# Altium schematic sheet TSALsch.SchDoc: TSAL
size A4; Author: Om Sarulkar; DrawnBy: Om Sarulkar; Organization: TS; DocumentNumber: 1; SheetNumber: 1; SheetTotal: 1
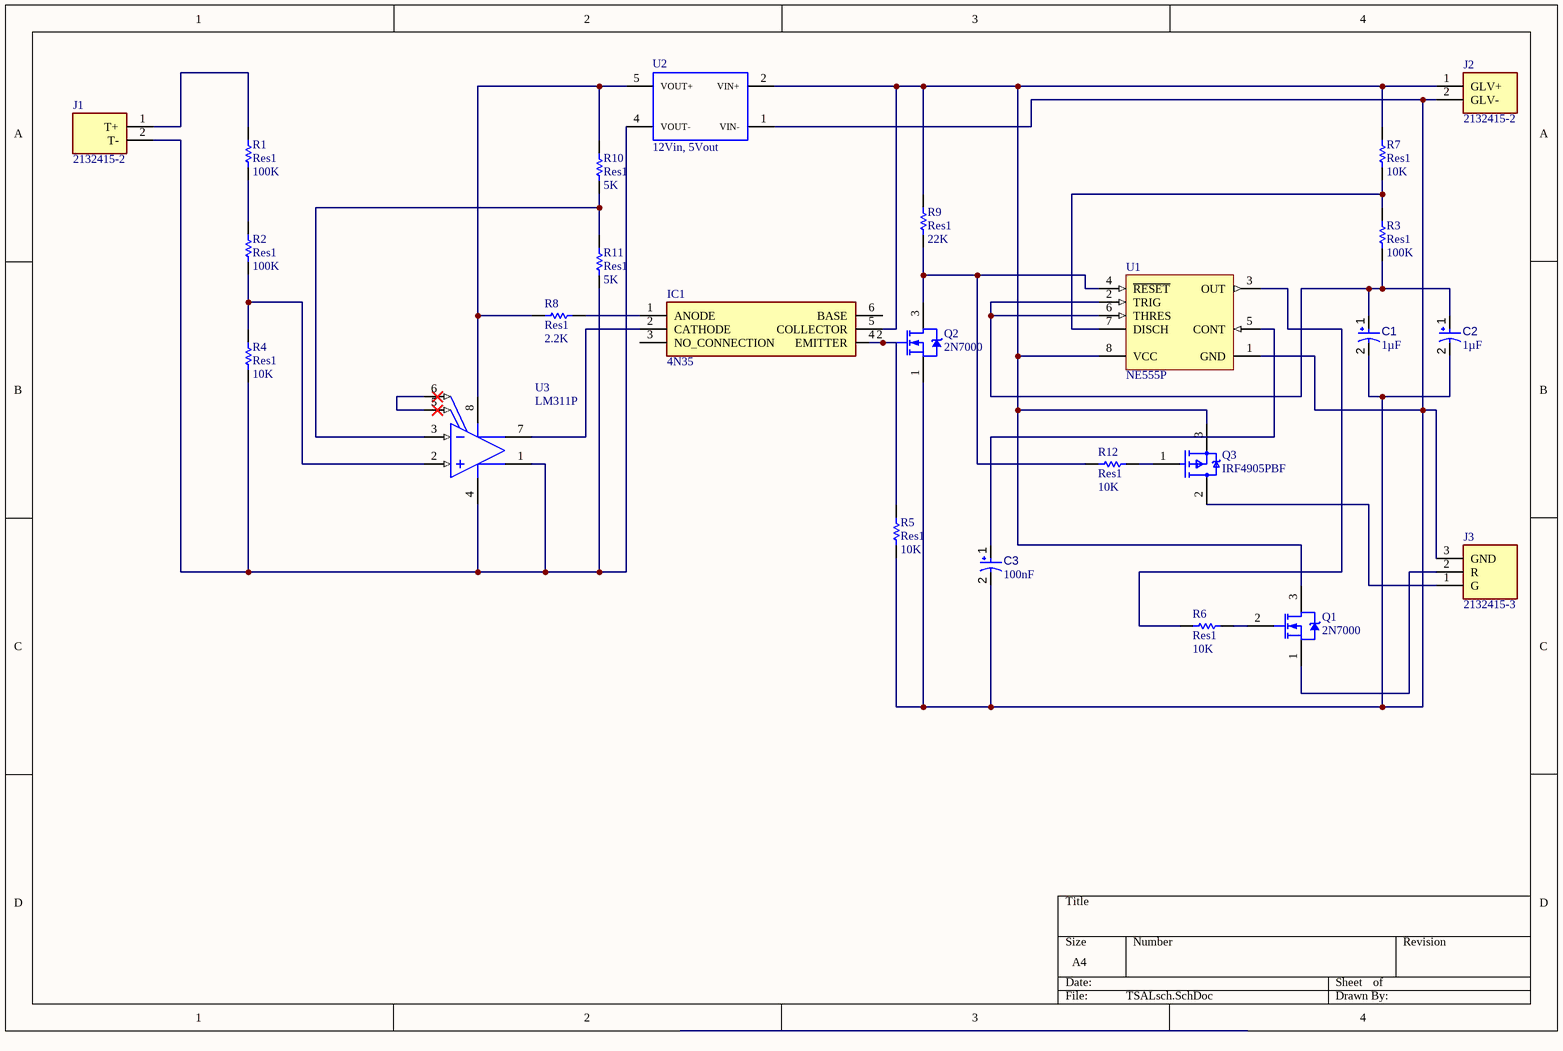
[diagram p0: TSALsch.SchDoc]

## Parts
C1  value 1µF  [CAPPR55-250-1120X630X1220]  (hidden comment: ECA-1HM470)
C2  value 1µF  [CAPPR55-250-1120X630X1220]  (hidden comment: ECA-1HM470)
C3  value 100nF  [CAPPR55-250-1120X630X1220]  (hidden comment: ECA-1HM470)
IC1  4N35  [DIP762W56P254L864H508Q6N]
J1  2132415-2  [TE_2132415-2]
J2  2132415-2  [TE_2132415-2]
J3  2132415-3  [TE_2132415-3]
Q1  2N7000  [ONSC-TO-92-3-29-11_AM_BL]
Q2  2N7000  [ONSC-TO-92-3-29-11_AM_BL]
Q3  IRF4905PBF  [FP-PG-TO220-3-MFG]
R1  Res1  value 100K  [AXIAL-0.3]
R2  Res1  value 100K  [AXIAL-0.3]
R3  Res1  value 100K  [AXIAL-0.3]
R4  Res1  value 10K  [AXIAL-0.3]
R5  Res1  value 10K  [AXIAL-0.3]
R6  Res1  value 10K  [AXIAL-0.3]
R7  Res1  value 10K  [AXIAL-0.3]
R8  Res1  value 2.2K  [AXIAL-0.3]
R9  Res1  value 22K  [AXIAL-0.3]
R10  Res1  value 5K  [AXIAL-0.3]
R11  Res1  value 5K  [AXIAL-0.3]
R12  Res1  value 10K  [AXIAL-0.3]
U1  NE555P  [P0008A]
U2  12Vin, 5Vout  [SMT-8]
U3  LM311P  [P0008A]

## Nets
NetC1_1: C1.1 C2.1 R3.1 U1.2(TRIG) U1.6(THRES)
NetC1_2: C1.2 C2.2 C3.2 J2.2(GLV-) J3.3(GND) Q2.1(S) R5.1 U1.1(GND) U2.1(VIN-)
NetC3_1: C3.1 U1.5(CONT)
NetIC1_1: IC1.1(ANODE) R8.2
NetIC1_2: IC1.2(CATHODE) U3.7(COL_OUT)
NetIC1_4: IC1.4(EMITTER) Q2.2(G) R5.2
NetIC1_5: IC1.5(COLLECTOR) J2.1(GLV+) Q1.3(D) Q3.3(SOURCE) R7.2 R9.2 U1.8(VCC) U2.2(VIN+)
NetJ1_1: J1.1(T+) R1.2
NetJ1_2: J1.2(T-) R4.1 R11.1 U2.4(VOUT-) U3.1(EMIT_OUT) U3.4(VCC-)
NetJ3_1: J3.1(G) Q3.2(DRAIN)
NetJ3_2: J3.2(R) Q1.1(S)
NetQ1_2: Q1.2(G) R6.2
NetQ2_3: Q2.3(D) R9.1 R12.1 U1.4(~{RESET})
NetQ3_1: Q3.1(GATE) R12.2
NetR1_1: R1.1 R2.2
NetR2_1: R2.1 R4.2 U3.2(IN+)
NetR3_2: R3.2 R7.1 U1.7(DISCH)
NetR6_1: R6.1 U1.3(OUT)
NetR8_1: R8.1 R10.2 U2.5(VOUT+) U3.8(VCC+)
NetR10_1: R10.1 R11.2 U3.3(IN-)
NetU3_5: U3.5(BALANCE) U3.6(BAL/STRB)

Not connected (* = marked no-connect by the designer): IC1 3(NO_CONNECTION) 6(BASE)

## Library data of the parts
C1-C3 = CMP-001-00031-6: Aluminum Electrolytic Capacitor, 47 uF, +/-20%, 50 V, -40 to 85 degC, 2-Pin THD, RoHS, Bulk; Manufacturer: Panasonic; Ripple Current (AC): 130mA; Tolerance: 20%; Voltage Rating: 50V; Packaging: Bulk; Manufacturer URL: http://www.panasonic.com/; Package Quantity: 200; Capacitor Type: Electrolytic; Pins: 2; Case/Package: Radial; Diameter: 6.3mm; Datasheet URL: https://industrial.panasonic.com/cdbs/www-data/pdf/RDF0000/DMF0000COL72.pdf; RoHS Compliant: True; Ripple Current: 130mA; Max Operating Temperature: 85°C; Datasheet Version: Apr-16; Mounting Technology: TH; Min Operating Temperature: -40°C; Package Reference: CAPPR55-250-1120X630X1220; Package Description: 2-Pin Radial Lead, Dia 6.3 mm, Height 12.2 mm; Lead Pitch: 2.5mm
IC1 = 4N35: Integrated Circuit; Manufacturer_Name: ON Semiconductor; Datasheet Link: https://eu.mouser.com/datasheet/2/308/Fairchild%20Semiconductor_4n25-28_35-37_h11a1-a5-1190949.pdf; Height: 5.08mm; Manufacturer_Part_Number: 4N35; Mouser Part Number: 512-4N35; Mouser Price/Stock: https://www.mouser.co.uk/ProductDetail/ON-Semiconductor-Fairchild/4N35?qs=9h%252BT%2FFFCxR8I%2FJMe3yKdFg%3D%3D
J1 J2 = 2132415-2: Conn Shrouded Header HDR 2 POS 2.5mm Solder ST Thru-Hole Bag/Box; Product_Type: Connector; Number_of_Positions: 2; Centerline_Pitch: 2.5 mm[.098 in]; MF: TE Connectivity; SnapEDA_Link: https://www.snapeda.com/parts/2132415-2/TE%20Connectivity%20AMP%20Connectors/view-part/2233226/?ref=snap; Digi-Key_Part_Number: A101065-ND; MP: 2132415-2; Purchase-URL: https://pricing.snapeda.com/search/part/2132415-2/?ref=eda; Package: None; Value: *; Check_prices: https://www.snapeda.com/parts/2132415-2/TE%20Connectivity%20AMP%20Connectors/view-part/2233226/?ref=eda
J3 = 2132415-3: Conn Shrouded Header HDR 3 POS 2.5mm Solder ST Thru-Hole Bag/Box; Product_Type: Connector; Centerline_Pitch: 2.5 mm[.098 in]; Number_of_Positions: 3; MF: TE Connectivity; Availability: Unavailable; Package: None; SnapEDA_Link: https://www.snapeda.com/parts/2132415-3/TE%20Connectivity%20AMP%20Connectors/view-part/2469125/?ref=snap; MP: 2132415-3; Price: None; TE_purchase_URL: https://www.te.com/usa-en/product-2132415-3.html?te_bu=Cor&te_type=disp&te_campaign=seda_glo_cor-seda-global-disp-prtnr-fy19-seda-model-bom-cta_sma-317_1&elqCampaignId=32493; Value: *
Q1 Q2 = CMP-013-00020-3: Small Signal MOSFET, 200 mA, 60 V, N-Channel, 3-Pin TO-92, Bulk Box; Manufacturer: Fairchild Semiconductor; Nominal Vgs: 2.1V; Elements: 1; Package Version: Rev. AM; Rds On Max: 5Ohm; Input Capacitance: 50pF; Nominal Dual Supply Voltage: 60V; Power: 400mW; Max Operating Temperature: 150°C; Datasheet URL: http://www.onsemi.com/pub_link/Collateral/2N7000-D.PDF; Mounting Technology: TH; RoHS Compliant: True; Case/Package: TO-92; Package Quantity: 2000; Package Description: 3-Pin Transistor Outline, Body 4.825 x 3.685 mm, Pitch 1.27 mm; Pins: 3; Min Operating Temperature: -55°C; Packaging: Bulk; Package Reference: TO-92-3-29-11_AM_BL; Datasheet Version: Rev. 8, 04/2011
Q3 = CMP-32901-000200-1: MOSFET P-CH 55V 74A TO-220AB; Drain to Source Resistance: 20mR; Input Capacitance: 3.4nF; Max Dual Supply Voltage: -55V; Power Dissipation: 200W; Turn-On Delay Time: 18ns; Element Configuration: Single; Threshold Voltage: -4V; Gate to Source Voltage (Vgs): 20V; Turn-Off Delay Time: 61ns; Number of Pins: 3; Packaging: Rail/Tube; RoHS Compliant: Yes; REACH SVHC: No SVHC; Halogen Free: Halogen Free; Max Power Dissipation: 200W; Drain to Source Breakdown Voltage: -55V; Length: 0.414inch; Drain to Source Voltage (Vdss): -55V; Height: 0.6inch; Case/Package: TO-220; Width: 0.185inch; Continuous Drain Current (ID): 74A; Mount: Through Hole; Min Operating Temperature: -55°C; Lead Free: Lead Free; Max Operating Temperature: 175°C; Rds On Max: 20mR
R1-R12 = Res1: Resistor; Published: 8-Jun-2000; LatestRevisionDate: 17-Jul-2002; LatestRevisionNote: Re-released for DXP Platform.; PackageReference: AXIAL-0.3; Publisher: Altium Limited; PackageDescription: Axial Device, Thru-Hole; 2 Leads; 0.3 in Pin Spacing
U1 = CMP-2000-04954-1: Precision Timer, 4.5 to 16 V, 0 to 70 degC, 8-Pin DIP, Pb-Free, Tube; Manufacturer: TexasInstruments; Maximum High Level Output Current: -200mA; Number of Internal Timers: 1; Operating Supply Voltage: 5; Maximum Low Level Output Current: 200mA; Rad Hard: No; Packaging: Rail/Tube; Manufacturer URL: http://www.ti.com/; Package Reference: P8; Package Description: 8-Pin Double In-line Package, Body 9.59 x 6.35 mm, Pitch 2.54 mm; Package URL: http://www.ti.com/lit/ml/mpdi001b/mpdi001b.pdf; Type: Standard; Datasheet URL: http://www.ti.com/general/docs/lit/getliterature.tsp?genericPartNumber=NE555&fileType=pdf; Category: Timer; Package: 8PDIP; Datasheet Version: Rev. I, 09/2014
U2 = 176920522: MagI3C-FISM Fixed Isolated SIP Module, SMT-8, 12Vin, 5Vout; Isolation Voltage: 2000V; Input Voltage: 12V; Output Voltage: 5V; ComponentLink1Description: Manufacturer; ComponentLink1URL: http://www.we-online.de; ComponentLink2Description: Datasheet; ComponentLink2URL: https://katalog.we-online.de/pm/datasheet/176920522.pdf; Operating Temperature: -40 to +100degC; Mounting Technology: SMT; Part Number: 176920522; Packaging: Tape and Reel; Published Date: October 2019; Publisher: Wurth Elektronik; Size: SMT-8
U3 = CMP-014-00015-1: Quad Differential Comparator, 3.5 to 30 V, 0 to 70 degC, 8-Pin PDIP (P), Pb-Free (RoHS), Tube; Manufacturer: Texas Instruments (TI); Propagation Delay: 115ns; Nominal Voltage Gain: 106.02dB; Elements: 1; Nominal Supply Voltage: 12V; Nominal Supply Current: 7.5mA; Min Supply Voltage: 3.5V; Max Supply Voltage: 30V; Package Version: 4040082/E, 04/2010; Min Dual Supply Voltage: 1.75V; Max Dual Supply Voltage: 15V; Nominal Dual Supply Voltage: 12V; Case/Package: PDIP; Package Reference: P0008A; Package URL: http://www.ti.com/lit/ml/mpdi001b/mpdi001b.pdf; RoHS Compliant: True; Pins: 8; Datasheet URL: http://www.ti.com/general/docs/lit/getliterature.tsp?genericPartNumber=LM311&fileType=pdf; Mounting Technology: TH; Max Operating Temperature: 70°C; Package Quantity: 50; Min Operating Temperature: 0°C; Package Description: 8-Pin Double In-line Package, Body 9.59 x 6.35 mm, Pitch 2.54 mm; Datasheet Version: SLCS007I, 06/2015; Channels: 1; Manufacturer URL: http://www.ti.com/; Packaging: Rail/Tube